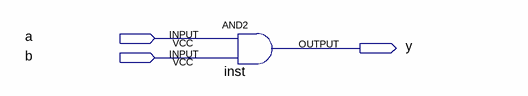
[diagram p0: schematic sheet]
// Quartus schematic Block1.bdf as structural Verilog: 1 symbols, 3 pins
module Block1 (
  input  a,
  input  b,
  output y
);

  and inst (y, a, b);
endmodule
